# EAGLE design led-headlamp (EAGLE 7.6.0)
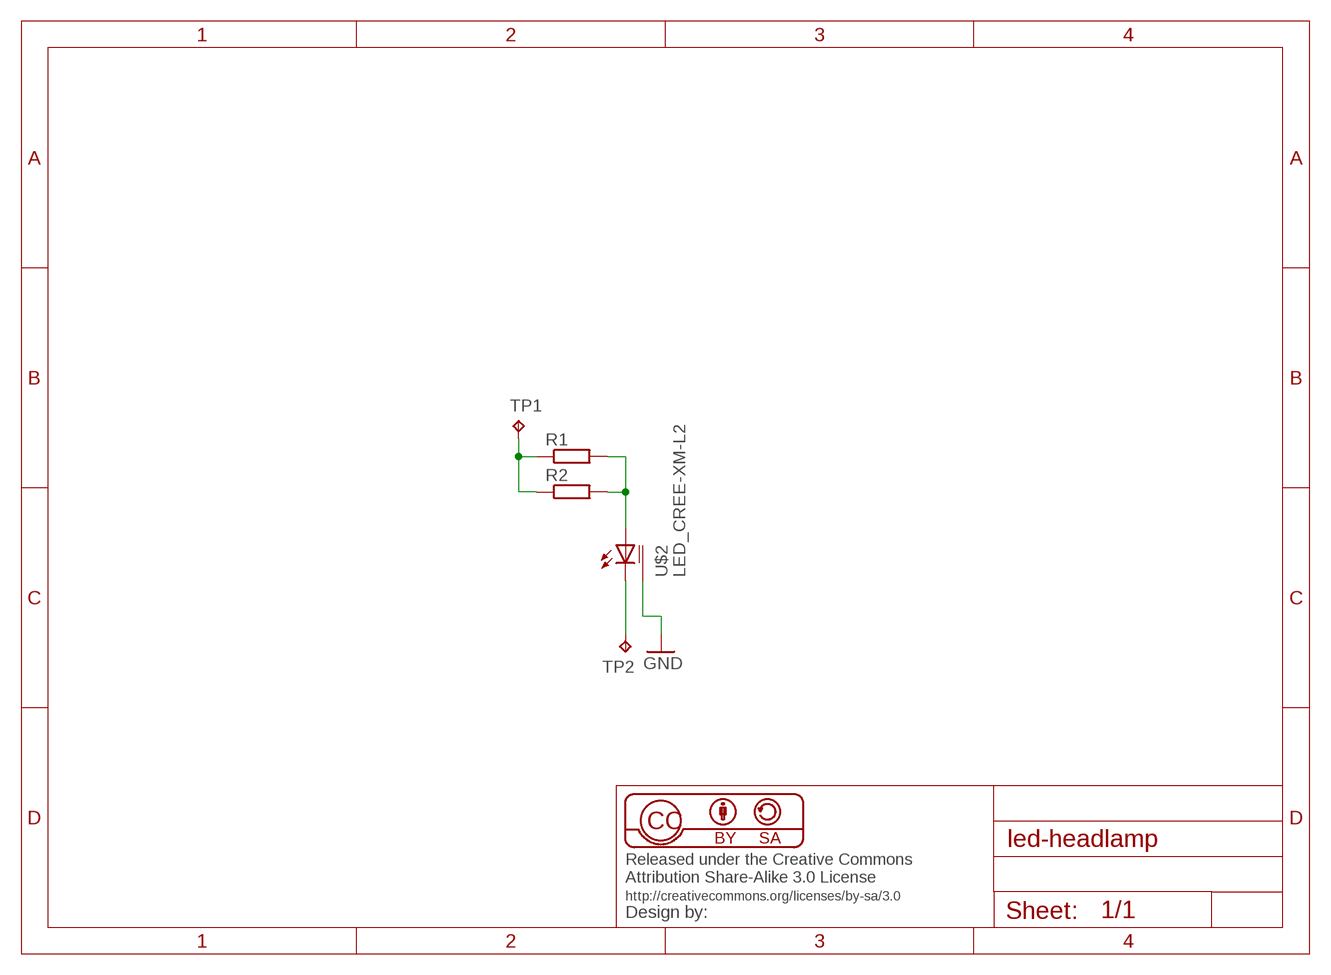
[diagram p0: schematic, sheet 1]

## Parts
R1  R-EU_R0805  [R0805]
R2  R-EU_R0805  [R0805]
TP1  TPTP18R  [TP18R]
TP2  TPTP18R  [TP18R]
U$2  LED_CREE-XM-L2  [XLAMP_5X5]

## Nets
GND: U$2.TH
N$1: TP2.TP U$2.K(C)
N$2: R1.1 R2.1 TP1.TP
N$3: R1.2 R2.2 U$2.A

## Library data of the parts
R1 R2 = rcl:R-EU_: RESISTOR, European symbol
TP1 TP2 = testpad:TP: Test pad
U$2 = balto:LED_CREE-XM-L2: CREE XLamp XM-L2 LEDs

## Board
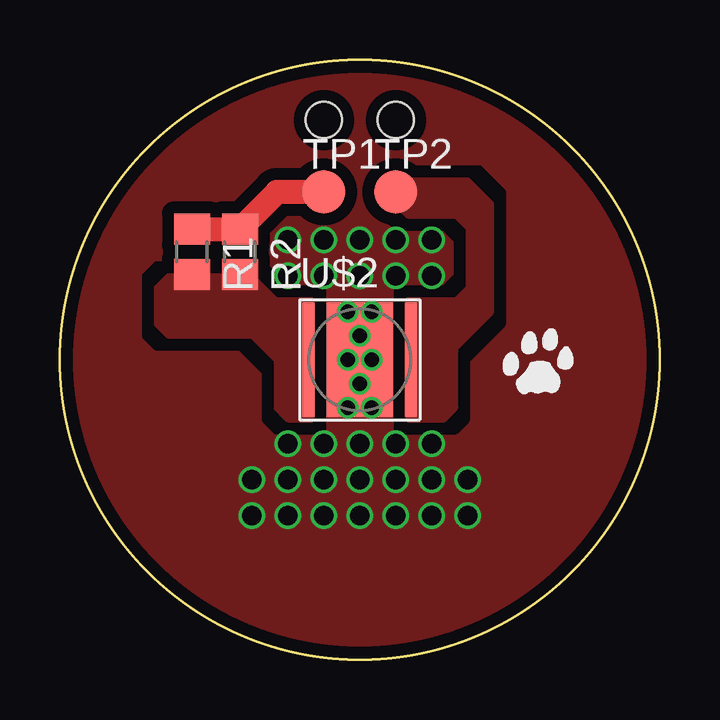
[diagram p1: board, top side]
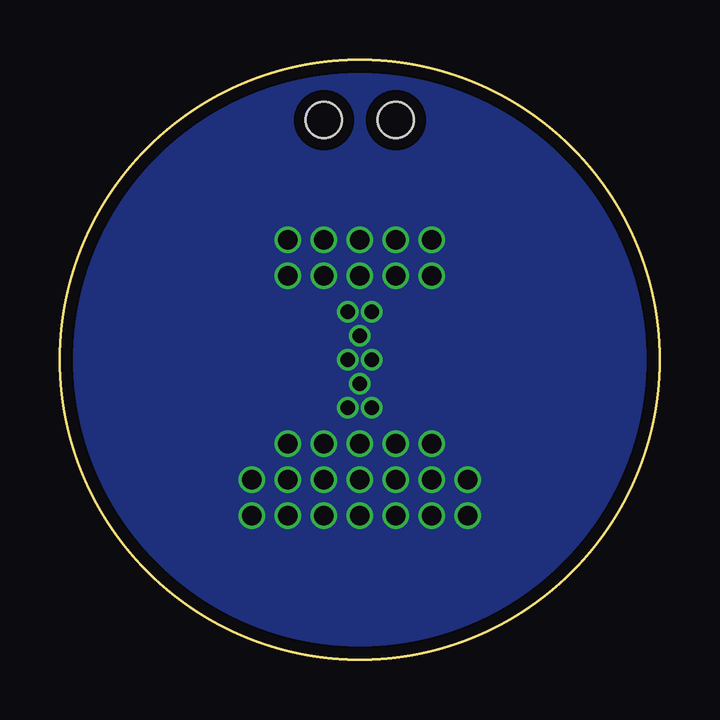
[diagram p2: board, bottom side, seen from below]

Size 25 x 25 mm. Coordinates in mm from the lower left corner, seen from the top.
Outline: circle at 12.5,12.5 radius 12.5
Copper layers (1*16): Top 0.035mm / dielectric 1.5mm / Bottom 0.035mm
Design rules "balto *": minimum track width 6mil, minimum drill 13mil, track to track 6mil, track to pad 6mil, pad to pad 6mil, via to via 6mil, smd to smd 6mil, copper to edge 15mil, drill to drill 6mil, minimum pad ring 6mil, minimum via ring 6mil, stop-mask expansion 2mil, vias tented up to drill 1mm, thermal gap 8mil
Holes 1.5 mm at 11,22.5 14,22.5

### Footprints (pad centres in the part's own frame; a part is rotated, then mirrored left to right if it is on the bottom)
R0805 = smd 1.3 x 1.5: 1 -0.95,0; 2 0.95,0
TP18R = smd 1.8 x 1.8: TP 0,0
XLAMP_5X5 = smd 0.5 x 4.78: A -2.14,0; K 2.14,0 | smd 2.78 x 4.78: TH 0,0

### Placement (x,y rotation side)
R1  5.5,17 270 top
R2  7.5,17 270 top
TP1  11,19.5 0 top
TP2  14,19.5 0 top
U$1  [CAT-L]  20,12 0 top
U$2  12.5,12.5 0 top

### Tracks (layer width: path | path; a pad name or v marks a point on that pad's centre or on a via)
GND  (via drill 0.6, 0.8)
  other vias: 12.5,9 11,9 9.5,9 14,9 15.5,9 12.5,16 11,16 11,17.5 12.5,17.5 14,17.5 14,16 15.5,16 15.5,17.5 9.5,17.5 9.5,16 9.5,7.5 11,7.5 12.5,7.5 14,7.5 15.5,7.5 15.5,6 14,6 12.5,6 11,6 9.5,6 12.5,11.5 12,10.5 13,10.5 12,12.5 13,12.5 12.5,13.5 12,14.5 13,14.5 8,7.5 8,6 17,7.5 17,6
  pour Top (isolate 0.5, rank 2, no thermals): -1,-1 25,-1 25,26 -1,26
  pour Bottom (isolate 0.5, rank 2, no thermals): -2,-2 26,-2 26,27 -2,27
N$1
  pour Top (no thermals): 15,18.5 16.5,18.5 17,18 17,15.5 16.5,15 14.5,15 14.5,10 16,10 16.5,10.5 16.5,13 18,14.5 18,19 17,20 14.5,20 14,19.5 14,19 14.5,18.5
N$2
  Top 1: R1.1 R2.1 9.05,19.5 TP1.TP
N$3
  pour Top (no thermals): 10.5,10 10.5,15 9,15 8.5,15.5 8,16 4.5,16 4,15.5 4,14 4.5,13.5 8,13.5 9,12.5 9,10.5 9.5,10